# EAGLE design POVD-2 (EAGLE 6.6.0)
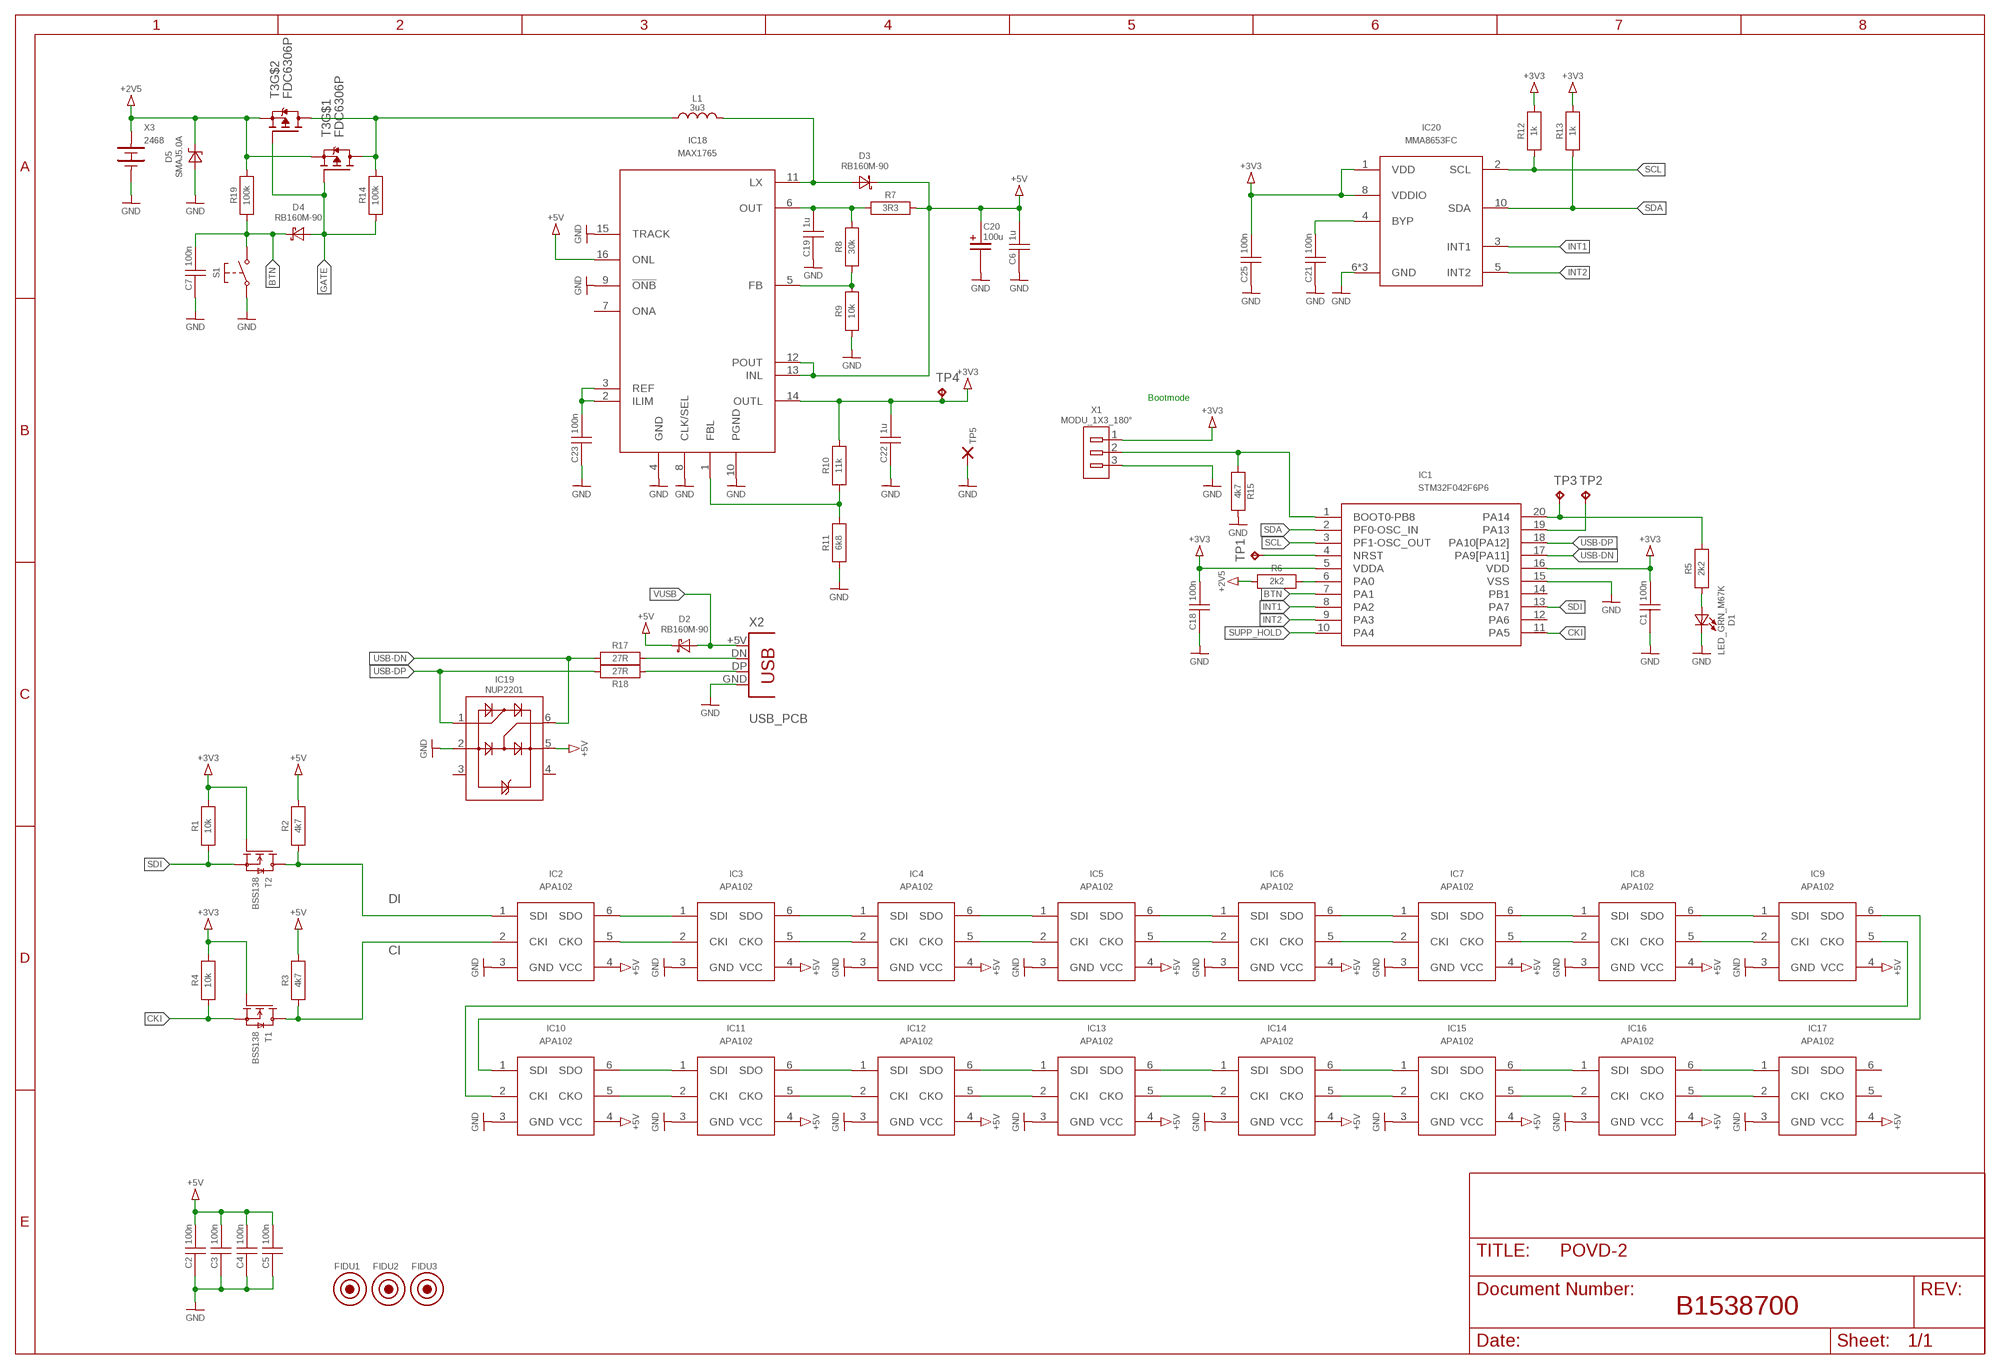
[diagram p0: schematic, sheet 1]

## Parts
C1  100n  C1206  [SM_1206]
C2  100n  C1206  [SM_1206]
C3  100n  C1206  [SM_1206]
C4  100n  C1206  [SM_1206]
C5  100n  C1206  [SM_1206]
C6  1u  C1206  [SM_1206]
C7  100n  C1206  [SM_1206]
C18  100n  C1206  [SM_1206]
C19  1u  C1206  [SM_1206]
C20  100u  CPOLSIZE-D  [SM_SIZE-D]
C21  100n  C1206  [SM_1206]
C22  1u  C1206  [SM_1206]
C23  100n  C1206  [SM_1206]
C25  100n  C1206  [SM_1206]
D1  LED_GRN_M67K  [SM_LED_M67K]
D2  RB160M-90  [SM_SOD123_POL]
D3  RB160M-90  [SM_SOD123_POL]
D4  RB160M-90  [SM_SOD123_POL]
D5  SMAJ5.0A  [SM_DO214AC_POL]
FIDU1  FIDU_ROUND_NEW  [FIDUCIAL_LOETSTOPP]
FIDU2  FIDU_ROUND_NEW  [FIDUCIAL_LOETSTOPP]
FIDU3  FIDU_ROUND_NEW  [FIDUCIAL_LOETSTOPP]
IC1  STM32F042F6P6  [SM_TSSOP20]
IC2  APA102  [SM_LED_PLCC6]
IC3  APA102  [SM_LED_PLCC6]
IC4  APA102  [SM_LED_PLCC6]
IC5  APA102  [SM_LED_PLCC6]
IC6  APA102  [SM_LED_PLCC6]
IC7  APA102  [SM_LED_PLCC6]
IC8  APA102  [SM_LED_PLCC6]
IC9  APA102  [SM_LED_PLCC6]
IC10  APA102  [SM_LED_PLCC6]
IC11  APA102  [SM_LED_PLCC6]
IC12  APA102  [SM_LED_PLCC6]
IC13  APA102  [SM_LED_PLCC6]
IC14  APA102  [SM_LED_PLCC6]
IC15  APA102  [SM_LED_PLCC6]
IC16  APA102  [SM_LED_PLCC6]
IC17  APA102  [SM_LED_PLCC6]
IC18  MAX1765  [SM_QSOP16]
IC19  NUP2201  [TSOP6]
IC20  MMA8653FC  [SM_DFN10]
L1  3u3  L_MOS6020  [SM_L_MOS6020]
R1  10k  R1206  [SM_1206]
R2  4k7  R1206  [SM_1206]
R3  4k7  R1206  [SM_1206]
R4  10k  R1206  [SM_1206]
R5  2k2  R1206  [SM_1206]
R6  2k2  R1206  [SM_1206]
R7  3R3  R1206  [SM_1206]
R8  30k  R1206  [SM_1206]
R9  10k  R1206  [SM_1206]
R10  11k  R1206  [SM_1206]
R11  6k8  R1206  [SM_1206]
R12  1k  R1206  [SM_1206]
R13  1k  R1206  [SM_1206]
R14  100k  R1206  [SM_1206]
R15  4k7  R1206  [SM_1206]
R17  27R  R1206  [SM_1206]
R18  27R  R1206  [SM_1206]
R19  100k  R1206  [SM_1206]
S1  PUSH-BUTTON_SMD  [PUSH-BUTTON_SMD]
T1  BSS138  [SM_SOT23]
T2  BSS138  [SM_SOT23]
T3  FDC6306P  [TSOP6]
TP1  TPTP12R  [TP12R]
TP2  TPTP12R  [TP12R]
TP3  TPTP12R  [TP12R]
TP4  TPTP12R  [TP12R]
TP5  CHECKER_1206  [SM_RCW_1206]
X1  MODU_1X3_180°  [MODU_3X1_180°]
X2  USB_PCB  [USB_PCB]
X3  2468  [2468]

## Nets
+2V5: D5.C R6.2 R19.2 T3.2(S) T3.5(S) X3.POS
+3V3: C1.2 C18.2 C22.2 C25.2 IC1.5(VDDA) IC1.16(VDD) IC18.14(OUTL) IC20.1(VDD) IC20.8(VDDIO) R1.2 R4.2 R10.2 R12.2 R13.2 T1.1(G) T2.1(G) TP4.TP X1.1
+5V: C2.2 C3.2 C4.2 C5.2 C6.2 C20.POS D2.C D3.C IC2.4(VCC) IC3.4(VCC) IC4.4(VCC) IC5.4(VCC) IC6.4(VCC) IC7.4(VCC) IC8.4(VCC) IC9.4(VCC) IC10.4(VCC) IC11.4(VCC) IC12.4(VCC) IC13.4(VCC) IC14.4(VCC) IC15.4(VCC) IC16.4(VCC) IC17.4(VCC) IC18.12(POUT) IC18.13(INL) IC18.16(ONL) IC19.5(VP) R2.2 R3.2 R7.2
BTN: C7.2 D4.C IC1.7(PA1) R19.1 S1.3(S) S1.4(S)
CI: IC2.2(CKI) R3.1 T1.3(D)
CKI: IC1.11(PA5) R4.1 T1.2(S)
DI: IC2.1(SDI) R2.1 T2.3(D)
GATE: D4.A R14.1 T3.1(G) T3.3(G)
GND: C1.1 C2.1 C3.1 C4.1 C5.1 C6.1 C7.1 C18.1 C19.1 C20.NEG C21.1 C22.1 C23.1 C25.1 D1.C D5.A IC1.15(VSS) IC2.3(GND) IC3.3(GND) IC4.3(GND) IC5.3(GND) IC6.3(GND) IC7.3(GND) IC8.3(GND) IC9.3(GND) IC10.3(GND) IC11.3(GND) IC12.3(GND) IC13.3(GND) IC14.3(GND) IC15.3(GND) IC16.3(GND) IC17.3(GND) IC18.4(GND) IC18.8(CLK/SEL) IC18.9(!ONB) IC18.10(PGND) IC18.15(TRACK) IC19.2(GND) IC20.6(GND) IC20.7(GND) IC20.9(GND) R9.1 R11.1 R15.2 S1.1(P) S1.2(P) TP5.1(P) X1.3 X2.GND X3.NEG
INT1: IC1.8(PA2) IC20.3(INT1)
INT2: IC1.9(PA3) IC20.5(INT2)
N$1: IC2.6(SDO) IC3.1(SDI)
N$2: IC2.5(CKO) IC3.2(CKI)
N$3: R17.2 X2.DN
N$4: IC3.6(SDO) IC4.1(SDI)
N$5: IC3.5(CKO) IC4.2(CKI)
N$6: R18.1 X2.DP
N$7: IC4.6(SDO) IC5.1(SDI)
N$8: IC4.5(CKO) IC5.2(CKI)
N$9: D1.A R5.1
N$10: IC6.6(SDO) IC7.1(SDI)
N$11: IC6.5(CKO) IC7.2(CKI)
N$12: IC1.6(PA0) R6.1
N$13: IC7.6(SDO) IC8.1(SDI)
N$14: IC7.5(CKO) IC8.2(CKI)
N$15: L1.1 R14.2 T3.4(D) T3.6(D)
N$16: IC8.6(SDO) IC9.1(SDI)
N$17: IC8.5(CKO) IC9.2(CKI)
N$18: IC1.4(NRST) TP1.TP
N$19: IC10.6(SDO) IC11.1(SDI)
N$20: IC10.5(CKO) IC11.2(CKI)
N$21: IC1.1(BOOT0-PB8) R15.1 X1.2
N$22: IC11.6(SDO) IC12.1(SDI)
N$23: IC11.5(CKO) IC12.2(CKI)
N$24: IC1.20(PA14) R5.2 TP3.TP
N$25: IC12.6(SDO) IC13.1(SDI)
N$26: IC12.5(CKO) IC13.2(CKI)
N$27: IC1.19(PA13) TP2.TP
N$28: IC14.6(SDO) IC15.1(SDI)
N$29: IC14.5(CKO) IC15.2(CKI)
N$31: IC15.6(SDO) IC16.1(SDI)
N$32: IC15.5(CKO) IC16.2(CKI)
N$33: C19.2 IC18.6(OUT) R7.1 R8.2
N$34: IC16.6(SDO) IC17.1(SDI)
N$35: IC16.5(CKO) IC17.2(CKI)
N$36: IC18.5(FB) R8.1 R9.2
N$37: D3.A IC18.11(LX) L1.2
N$38: IC5.5(CKO) IC6.2(CKI)
N$39: IC5.6(SDO) IC6.1(SDI)
N$40: IC18.1(FBL) R10.1 R11.2
N$41: IC9.5(CKO) IC10.2(CKI)
N$42: IC9.6(SDO) IC10.1(SDI)
N$44: IC13.5(CKO) IC14.2(CKI)
N$45: IC13.6(SDO) IC14.1(SDI)
N$46: C21.2 IC20.4(BYP)
N$48: C23.2 IC18.2(ILIM) IC18.3(REF)
SCL: IC1.3(PF1-OSC_OUT) IC20.2(SCL) R12.1
SDA: IC1.2(PF0-OSC_IN) IC20.10(SDA) R13.1
SDI: IC1.13(PA7) R1.1 T2.2(S)
SUPP_HOLD: IC1.10(PA4)
USB-DN: IC1.17(PA9[PA11]) IC19.6(IO2) R17.1
USB-DP: IC1.18(PA10[PA12]) IC19.1(IO1) R18.2
VUSB: D2.A X2.+5V
Unconnected: IC1.12(PA6) IC1.14(PB1) IC17.5(CKO) IC17.6(SDO) IC18.7(ONA) IC19.3(NC1) IC19.4(NC2)

## Notes on the sheet
- Bootmode
- B1538700

## Library data of the parts
C1-C5 C7 C18 C21 C23 C25 = DTP_RCL:C: Capacitor IMS: IMS Capacitors <file:\\omicron.at\dfs\GLOBAL\OMICRON\Synergies\Innovation\Components\CompIMS\_html\Capacitor.html> Version Date Employee Description 1.0 2015-07-15 ChrRaj00 Initial Version; PARTNR: E0001400
C6 C19 C22 = DTP_RCL:C: Capacitor IMS: IMS Capacitors <file:\\omicron.at\dfs\GLOBAL\OMICRON\Synergies\Innovation\Components\CompIMS\_html\Capacitor.html> Version Date Employee Description 1.0 2015-07-15 ChrRaj00 Initial Version; PARTNR: E0487200
C20 = DTP_RCL:CPOL: Capacitor IMS: IMS Capacitors polarized <file:\\omicron.at\dfs\GLOBAL\OMICRON\Synergies\Innovation\Components\CompIMS\_html\Capacitor_Polarized.html> Version Date Employee Description 1.0 2015-08-26 ChrRaj00 Initial Version; PARTNR: E0242200
D1 = LED:LED: LED IMS Master M67K: E0620600 <file:\\omicron.at\dfs\GLOBAL\OMICRON\Synergies\Innovation\Components\CompIMS\Optical\LED\E0620600_LS_M67K-J2L1-1\E0620600.html> IMS Master LGA67K: E0392701 <file:\\omicron.at\dfs\GLOBAL\OMICRON\Synergies\Innovation\Components\CompIMS\Optical\LED\E0392701_LGA67K\E0392701.html> Version Date Employee Description 1.1 2016-05-02 MarStr00 Added 90° LEDs 1.0 2015-11-03 MarStr00 Initial Version; INFO: Function?; PARTNR: E0620700
D2-D4 = Diode:RB160M-90: Diode RB160M-90 Vr = 90V Vf = 0.73V If = 1A Cj = 12pF IMS: E0617200 <file:\\omicron.at\dfs\GLOBAL\OMICRON\Synergies\Innovation\Components\CompIMS\Diode\Schottky\E0617200_RB160M-90\E0617200.html> History Version Date Employee Description 1.0 2015-08-10 ChrRaj00 InitialVersion; PARTNR: E0617200
D5 = Diode:SMAJ*A: SMAJ TVS unidir DO214AC SMAJ15A: Vrmin = 16.7 V Cj = 400 pF Ppulse = 400 W IMS: E1126800 <file:\\omicron.at\dfs\GLOBAL\OMICRON\Synergies\Innovation\Components\CompIMS\Diode\TVS\E1126800_SMCJ15A\E1126800.html> Version Date Employee Description 1.1 2016-01-12 MarStr00 Renamed device with wildcard 1.0 2015-09-15 MarStr00 Initial Version; PARTNR: E1127500
FIDU1-FIDU3 = DTP_Misc:FIDU_ROUND_NEW: Use this Fiducial for new projects!! Fiducial filled with solder mask
IC1 = POVLibrary:STM32F042F6P6
IC2-IC17 = POVLibrary:APA102
IC18 = POVLibrary:MAX1765
IC19 = DTP_IC:NUP2201: ESD Protection Diodes with Low Clamping Voltage NUP2201MR6 IMS: E0439000 <file://omicron.at/dfs/GLOBAL/OMICRON/Synergies/Innovation/Components/CompIMS/Diode/TVS/E0439000_NUP2201MR6/E0439000.html> Version Date Employee Description 1.0 ? ? Initial Version 1.1 2016-04-12 MarSch06 added description; PARTNR: E0439000
IC20 = POVLibrary:MMA8653FC
L1 = DTP_RCL:L: Inductor IMS: IMS Inductors <file:\\omicron.at\dfs\GLOBAL\OMICRON\Synergies\Innovation\Components\CompIMS\_html\Inductor.html> Version Date Employee Description 1.0 2015-07-15 ChrRaj00 Initial Version; PARTNR: E0517800
R1 R4 R9 = DTP_RCL:R: Resistor IMS: IMS Resistors <file:\\omicron.at\dfs\GLOBAL\OMICRON\Synergies\Innovation\Components\CompIMS\_html\Resistor_Standard.html> Version Date Employee Description 1.4 2015-10-20 MarAig00 Added 4723 Package 1.3 2015-10-08 MarStr00 Added KH208-8 package 1.2 2015-10-01 MarStr00 Added 1218 package 1.1 2015-09-14 MarStr00 Added MELF0207 and 2512 packages 1.0 2015-07-15 ChrRaj00 Initial Version; PARTNR: E0002700
R2 R3 R15 = DTP_RCL:R: Resistor IMS: IMS Resistors <file:\\omicron.at\dfs\GLOBAL\OMICRON\Synergies\Innovation\Components\CompIMS\_html\Resistor_Standard.html> Version Date Employee Description 1.4 2015-10-20 MarAig00 Added 4723 Package 1.3 2015-10-08 MarStr00 Added KH208-8 package 1.2 2015-10-01 MarStr00 Added 1218 package 1.1 2015-09-14 MarStr00 Added MELF0207 and 2512 packages 1.0 2015-07-15 ChrRaj00 Initial Version; PARTNR: E0002200
R5 R6 = DTP_RCL:R: Resistor IMS: IMS Resistors <file:\\omicron.at\dfs\GLOBAL\OMICRON\Synergies\Innovation\Components\CompIMS\_html\Resistor_Standard.html> Version Date Employee Description 1.4 2015-10-20 MarAig00 Added 4723 Package 1.3 2015-10-08 MarStr00 Added KH208-8 package 1.2 2015-10-01 MarStr00 Added 1218 package 1.1 2015-09-14 MarStr00 Added MELF0207 and 2512 packages 1.0 2015-07-15 ChrRaj00 Initial Version; PARTNR: E0066600
R7 = DTP_RCL:R: Resistor IMS: IMS Resistors <file:\\omicron.at\dfs\GLOBAL\OMICRON\Synergies\Innovation\Components\CompIMS\_html\Resistor_Standard.html> Version Date Employee Description 1.4 2015-10-20 MarAig00 Added 4723 Package 1.3 2015-10-08 MarStr00 Added KH208-8 package 1.2 2015-10-01 MarStr00 Added 1218 package 1.1 2015-09-14 MarStr00 Added MELF0207 and 2512 packages 1.0 2015-07-15 ChrRaj00 Initial Version; PARTNR: E0821300
R8 R10 = DTP_RCL:R: Resistor IMS: IMS Resistors <file:\\omicron.at\dfs\GLOBAL\OMICRON\Synergies\Innovation\Components\CompIMS\_html\Resistor_Standard.html> Version Date Employee Description 1.4 2015-10-20 MarAig00 Added 4723 Package 1.3 2015-10-08 MarStr00 Added KH208-8 package 1.2 2015-10-01 MarStr00 Added 1218 package 1.1 2015-09-14 MarStr00 Added MELF0207 and 2512 packages 1.0 2015-07-15 ChrRaj00 Initial Version
R11 = DTP_RCL:R: Resistor IMS: IMS Resistors <file:\\omicron.at\dfs\GLOBAL\OMICRON\Synergies\Innovation\Components\CompIMS\_html\Resistor_Standard.html> Version Date Employee Description 1.4 2015-10-20 MarAig00 Added 4723 Package 1.3 2015-10-08 MarStr00 Added KH208-8 package 1.2 2015-10-01 MarStr00 Added 1218 package 1.1 2015-09-14 MarStr00 Added MELF0207 and 2512 packages 1.0 2015-07-15 ChrRaj00 Initial Version; PARTNR: E0195100
R12 R13 = DTP_RCL:R: Resistor IMS: IMS Resistors <file:\\omicron.at\dfs\GLOBAL\OMICRON\Synergies\Innovation\Components\CompIMS\_html\Resistor_Standard.html> Version Date Employee Description 1.4 2015-10-20 MarAig00 Added 4723 Package 1.3 2015-10-08 MarStr00 Added KH208-8 package 1.2 2015-10-01 MarStr00 Added 1218 package 1.1 2015-09-14 MarStr00 Added MELF0207 and 2512 packages 1.0 2015-07-15 ChrRaj00 Initial Version; PARTNR: E0002500
R14 R19 = DTP_RCL:R: Resistor IMS: IMS Resistors <file:\\omicron.at\dfs\GLOBAL\OMICRON\Synergies\Innovation\Components\CompIMS\_html\Resistor_Standard.html> Version Date Employee Description 1.4 2015-10-20 MarAig00 Added 4723 Package 1.3 2015-10-08 MarStr00 Added KH208-8 package 1.2 2015-10-01 MarStr00 Added 1218 package 1.1 2015-09-14 MarStr00 Added MELF0207 and 2512 packages 1.0 2015-07-15 ChrRaj00 Initial Version; PARTNR: E0002800
R17 R18 = DTP_RCL:R: Resistor IMS: IMS Resistors <file:\\omicron.at\dfs\GLOBAL\OMICRON\Synergies\Innovation\Components\CompIMS\_html\Resistor_Standard.html> Version Date Employee Description 1.4 2015-10-20 MarAig00 Added 4723 Package 1.3 2015-10-08 MarStr00 Added KH208-8 package 1.2 2015-10-01 MarStr00 Added 1218 package 1.1 2015-09-14 MarStr00 Added MELF0207 and 2512 packages 1.0 2015-07-15 ChrRaj00 Initial Version; PARTNR: E0023100
S1 = DTP_Switch:PUSH-BUTTON_SMD: Push Button Switch For SMD mounting Max Switching: 50mA @ 12V Switches:1 E-Nr.: E0869600 History Version Date Employee Description 1.0 2015.04.23 DanWin00 Initial Version; PARTNR: E0869600
T1 T2 = FET:BSS138: BSS138 NMOSFET 50V 0.2A 3E5 SOT23 Vmax = 50V Icont =0.2A Pd = 360mW Rdson = 3.5Ohm IMS: E0277100 <file:\\omicron.at\dfs\GLOBAL\OMICRON\Synergies\Innovation\Components\CompIMS\Transistor\NMOS\E0277100_BSS138\E0277100.html> History Version Date Employee Description 1.0 2015-11-13 ChrRaj00 Initial Version; PARTNR: E0277100
T3 = DTP_Semicond:FDC6306P; PARTNR: E0662100
TP1-TP4 = DTP_Connectors:TP: Test pad
TP5 = DTP_Connectors:CHECKER_1206: Checker 1p 1206 SMD RCWCTE IMS: E0395500 <\\omicron.at\DFS\GLOBAL\OMICRON\Synergies\Innovation\Components\CompIMS\Connector\5-PCB/E0395500_Checker_1p_1206_SMD_RCWCTE/E0395500.html> History Version Date Employee Description 1.1 2015.09.15 MarStr00 Value now visible on silkscreen for labeling 1.0 2014.09.05 ChrJoc00 Added prefix and description; PARTNR: E0395500
X1 = Connector_PCB:MODU_1X3_180°: Header Male 1x3p RM2,54 180° locking PCB Version Date Employee Description 1.0 2016-05-06 MarStr00 Initial Version
X2 = POVLibrary:USB_PCB
X3 = POVLibrary:2468

## Board
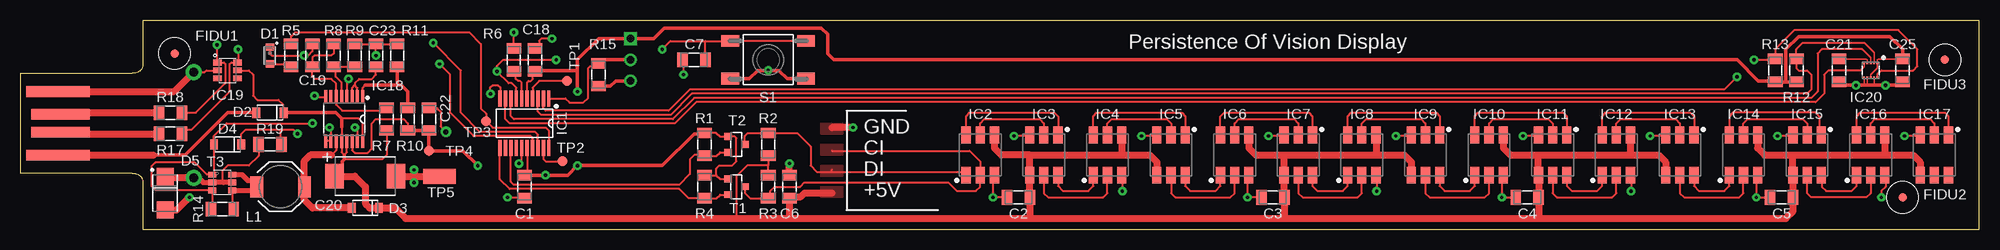
[diagram p1: board, top side]
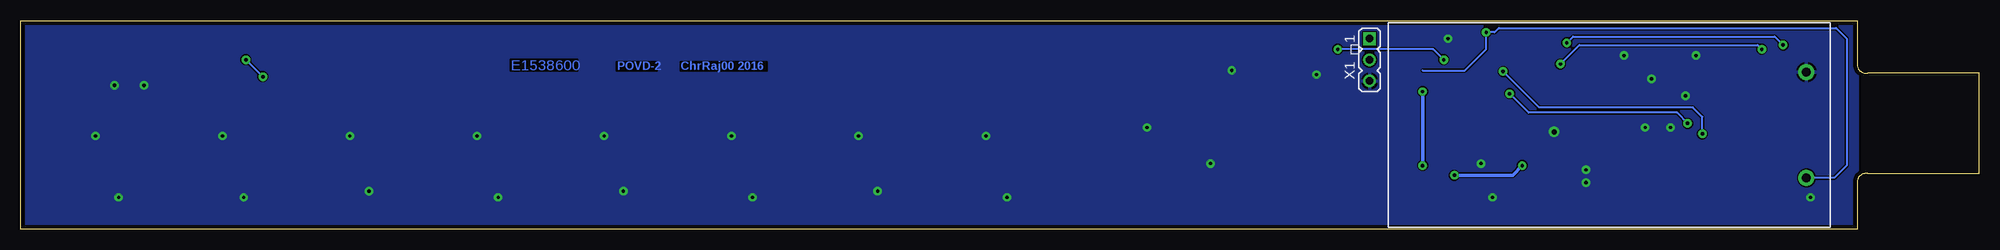
[diagram p2: board, bottom side, seen from below]

Size 234.6 x 25 mm. Coordinates in mm from the lower left corner, seen from the top.
Outline: 13.34,18.73 13.61,18.73 arc90 14.61,19.73 14.61,25 234.6,25 234.6,0 14.61,0 14.61,5.67 arc90 13.61,6.67 13.34,6.67
Copper layers (1*16): Top 0.035mm / dielectric 1.5mm / Bottom 0.035mm
Design rules "OMICRON_2Layer": minimum track width 6mil, minimum drill 0.3mm, track to track 6mil, track to pad 6mil, pad to pad 6mil, via to via 6mil, smd to smd 6mil, copper to edge 0.5mm, drill to drill 0.3mm, minimum pad ring 12mil, minimum via ring 12mil, stop-mask expansion 0mil, vias tented up to drill 0.3mm, thermal gap 10mil

### Footprints (pad centres in the part's own frame; a part is rotated, then mirrored left to right if it is on the bottom)
SM_1206 = smd 1.25 x 1.75: 1 -1.375,0; 2 1.375,0
SM_SIZE-D = smd 2.2 x 2.9: NEG 3.683,0; POS -3.683,0
SM_LED_M67K = smd 0.86 x 1.01: A -1,0; C 1,0
SM_SOD123_POL = smd 0.92 x 1.22: A -1.64,0; C 1.64,0
SM_DO214AC_POL = smd 2.03 x 2.03: A -2.032,0; C 2.032,0
FIDUCIAL_LOETSTOPP = smd 1.016 x 1.016: P$1 0,0
SM_TSSOP20 = smd 0.4 x 1.88: 1 -2.925,-2.97; 2 -2.275,-2.97; 3 -1.625,-2.97; 4 -0.975,-2.97; 5 -0.325,-2.97; 6 0.325,-2.97; 7 0.975,-2.97; 8 1.625,-2.97; 9 2.275,-2.97; 10 2.925,-2.97; 11 2.925,2.97; 12 2.275,2.97; 13 1.625,2.97; 14 0.975,2.97; 15 0.325,2.97; 16 -0.325,2.97; 17 -0.975,2.97; 18 -1.625,2.97; 19 -2.275,2.97; 20 -2.925,2.97
SM_LED_PLCC6 = smd 2 x 1.1: 1 -2.4,1.7; 2 -2.4,0; 3 -2.4,-1.7; 4 2.4,-1.7; 5 2.4,0; 6 2.4,1.7
SM_QSOP16 = smd 0.36 x 1.6: 1 -2.223,-2.655; 2 -1.587,-2.655; 3 -0.953,-2.655; 4 -0.318,-2.655; 5 0.318,-2.655; 6 0.953,-2.655; 7 1.587,-2.655; 8 2.223,-2.655; 9 2.223,2.655; 10 1.587,2.655; 11 0.953,2.655; 12 0.318,2.655; 13 -0.318,2.655; 14 -0.953,2.655; 15 -1.587,2.655; 16 -2.223,2.655
TSOP6 = smd 1 x 0.7: 1 -1.2,0.95; 2 -1.2,0; 3 -1.2,-0.95; 4 1.2,-0.95; 5 1.2,0; 6 1.2,0.95
SM_DFN10 = smd 0.3 x 0.225: 1 -0.9,0.8; 2 -0.9,0.4; 3 -0.9,0; 4 -0.9,-0.4; 5 -0.9,-0.8; 6 0.9,-0.8; 7 0.9,-0.4; 8 0.9,0; 9 0.9,0.4; 10 0.9,0.8
SM_L_MOS6020 = smd 1.52 x 2.54: 1 2.857,0; 2 -2.857,0
PUSH-BUTTON_SMD = smd 2.1 x 1.4: 1 -4.55,2.25; 2 4.55,2.25; 3 -4.55,-2.25; 4 4.55,-2.25
SM_SOT23 = smd 0.8 x 0.9: 1 -0.95,-1; 2 0.95,-1; 3 0,1
TP12R = smd 1.2 x 1.2: TP 0,0
SM_RCW_1206 = smd 1.8 x 3.9: 1 0,0
MODU_3X1_180° = drill 0.9 pad 1.52 square: 1 -2.54,0 | drill 0.9 pad 1.52: 2 0,0; 3 2.54,0
USB_PCB = smd 1.27 x 7.62: +5V -3.81,8.89; GND 3.81,8.89 | smd 1.27 x 6.985: DN -1.079,8.572; DP 1.079,8.572
2468 = drill 1.1 pad 1.93: NEG 23.625,6.35; POS 23.625,-6.35

### Placement (x,y rotation side)
C1  60.33,5.08 90 top
C2  119.51,3.81 0 top
C3  149.99,3.81 0 top
C4  180.47,3.81 0 top
C5  210.95,3.81 0 top
C6  92.08,5.08 270 top
C7  80.65,20.32 0 top
C18  61.59,20.32 270 top
C19  34.92,20.83 270 top
C20  41.28,6.35 0 top
C21  217.8,19.05 90 top
C22  48.89,13.21 270 top
C23  42.55,20.83 270 top
C25  225.42,19.05 90 top
D1  29.84,20.83 90 top
D2  29.84,13.97 0 top
D3  41.28,2.54 0 top
D4  24.77,10.16 0 top
D5  17.27,4.32 90 top
FIDU1  18.41,21.08 90 top
FIDU2  225.42,3.81 90 top
FIDU3  230.5,20.32 180 top
IC1  60.33,12.7 180 top
IC2  114.94,8.89 90 top
IC3  122.56,8.89 270 top
IC4  130.17,8.89 90 top
IC5  137.79,8.89 270 top
IC6  145.41,8.89 90 top
IC7  153.03,8.89 270 top
IC8  160.66,8.89 90 top
IC9  168.27,8.89 270 top
IC10  175.89,8.89 90 top
IC11  183.51,8.89 270 top
IC12  191.13,8.89 90 top
IC13  198.75,8.89 270 top
IC14  206.38,8.89 90 top
IC15  213.99,8.89 270 top
IC16  221.61,8.89 90 top
IC17  229.23,8.89 270 top
IC18  38.73,13.21 180 top
IC19  24.77,19.05 0 top
IC20  221.61,19.05 270 top
L1  31.12,5.08 180 top
R1  81.92,10.16 90 top
R2  89.54,10.16 270 top
R3  89.54,5.08 90 top
R4  81.92,5.08 90 top
R5  32.39,20.83 90 top
R6  59.06,20.32 90 top
R7  43.81,13.21 270 top
R8  37.47,20.83 90 top
R9  40,20.83 270 top
R10  46.36,13.21 270 top
R11  45.09,20.83 270 top
R12  212.72,19.05 270 top
R13  210.19,19.05 270 top
R14  24.13,2.41 0 top
R15  69.22,18.54 270 top
R17  17.91,11.43 180 top
R18  17.91,13.97 0 top
R19  29.84,10.16 180 top
S1  89.54,20.32 180 top
T1  85.73,5.08 270 top
T2  85.73,10.16 270 top
T3  24.13,5.59 0 top
TP1  65.41,17.78 180 top
TP2  64.9,8.13 180 top
TP3  55.75,12.95 180 top
TP4  48.89,9.4 0 top
TP5  50.17,6.35 90 top
X1  73.03,20.32 270 bottom
X2  13.34,12.7 90 top
X3  44.32,12.5 0 bottom

### Tracks (layer width: path | path; a pad name or v marks a point on that pad's centre or on a via)
+2V5  (via drill 0.4)
  Top 0.254: R6.2 v59.06,23.62 | R19.2 28.47,8.79 27.3,7.62 24.77,7.62 24.13,6.99 24.13,5.71 24.26,5.59
  Top 0.61: X3.POS 21.28,6.15 21.84,5.59 T3.2 24.26,5.59 T3.5
  Top 0.813: X3.POS 17.47,6.15 D5.C
  Bottom 0.254: X3.POS 17.34,6.15 15.88,7.62 15.88,22.86 17.14,24.13 57.53,24.13 58.04,23.62 v59.06,23.62 59.06,21.59 61.59,19.05 66.67,19.05
+3V3  (via drill 0.4)
  Top 0.2: C25.2 222.52,20.43 222.41,20.32 IC20.1 222.41,19.34 221.61,18.54 IC20.8
  Top 0.254: R4.2 83.33,6.46 | 83.33,6.46 83.76,6.03 T1.1 | IC18.14 39.69,9.46 40,9.14 41.53,9.14 42.04,9.65 42.04,12.7 42.55,13.21 45.85,13.21 46.36,12.7 R10.2 | IC1.16 60.65,6.78 C1.2 | IC1.5 60.65,17.6 60.83,17.78 61.09,17.78 61.34,18.03 61.34,18.8 C18.2 | 83.33,6.46 83.33,7.26 83.69,7.62 85.22,7.62 85.73,8.13 85.73,10.92 85.54,11.11 T2.1 83.76,11.11 83.33,11.54 82.02,11.54
  Top 0.406: 225.42,20.32 C25.2 225.42,21.59 223.9,23.11 212.98,23.11 211.45,21.59 211.45,17.68 | 211.45,17.68 R13.2 210.19,17.78 208.15,17.78 205.61,20.32 97.41,20.32 96.65,21.08 96.65,23.37 95.89,24.13 77.09,24.13 75.82,22.86 X1.1 69.22,22.86 66.67,20.32 66.67,19.05 | R12.2 211.45,17.68 | R10.2 C22.2 TP4.TP 52.96,9.4 v54.74,7.62 | 66.67,19.05 61.7,19.05 C18.2 | 81.92,11.43 82.02,11.54 R1.2 81.81,11.43 80.65,11.43 76.83,7.62 v66.67,7.62 65.51,6.46 v62.86,6.46 C1.2 | v66.67,16.51 66.67,19.05
  Bottom 0.406: v54.74,7.62 55.9,6.46 v62.86,6.46 | v66.67,16.51 v66.67,7.62
+5V
  Top 0.254: R3.2 89.54,7.62 | IC18.13 39.05,9.21 38.73,8.89 38.42,9.21 IC18.12 38.42,12.26 | R2.2 89.54,7.62 | 89.54,7.62 87,7.62 85.73,6.35 85.73,1.27 | R7.2 43.81,8.89 43.31,8.38 38.73,8.38 | IC19.5 27.3,19.05 27.81,18.54 27.81,16 28.32,15.49 30.86,15.49 31.37,14.99 31.37,14.09 D2.C | IC18.16 40.96,12.76 40.45,13.27 38.42,13.27
  Top 0.406: 38.73,8.89 38.73,8.38 38.48,8.13 38.48,6.35 C20.POS | D2.C 37.72,13.97 38.42,13.27 38.42,12.26
  Top 0.813: 120.86,8.89 IC3.4 120.88,6.46 C2.2 120.88,1.27 | 120.86,8.89 117.48,8.89 116.64,9.73 IC2.4 | 120.86,8.89 131.88,8.89 | 131.88,8.89 135.25,8.89 136.09,8.05 IC5.4 | IC4.4 131.88,8.89 | IC6.4 147.11,9.73 147.95,8.89 151.33,8.89 | 151.33,8.89 162.35,8.89 | 162.35,8.89 165.73,8.89 166.57,8.05 IC9.4 | IC8.4 162.35,8.89 | 151.33,8.89 IC7.4 151.36,6.46 C3.2 151.36,1.27 | IC10.4 177.59,9.73 178.44,8.89 181.81,8.89 | 181.81,8.89 192.83,8.89 | 192.83,8.89 196.22,8.89 197.05,8.05 IC13.4 | 181.81,8.89 IC11.4 181.84,6.46 C4.2 181.84,1.27 | IC12.4 192.83,8.89 | IC14.4 208.07,9.73 208.91,8.89 212.29,8.89 | 212.29,8.89 223.31,8.89 | 223.31,8.89 226.69,8.89 227.53,8.05 IC17.4 | IC16.4 223.31,8.89 | 212.29,8.89 IC15.4 212.29,3.81 C5.2 212.32,2.14 211.45,1.27 181.84,1.27 | 92.08,1.27 85.73,1.27 46.1,1.27 44.83,2.54 D3.C 41.78,2.54 41.28,3.05 41.28,5.08 40,6.35 38.48,6.35 | 92.08,1.27 120.88,1.27 | 120.88,1.27 151.36,1.27 | 151.36,1.27 181.84,1.27 | 92.08,1.27 C6.2 92.08,3.81 93.34,3.81 93.85,4.32 97.16,4.32
  pour Top: 95.89,3.81 95.89,5.08 98.42,5.08 98.42,3.81
BTN  (via drill 0.4)
  Top 0.254: IC1.7 59.35,16.98 58.8,17.53 58.42,17.53 v57.02,18.92 57.02,19.56 57.78,20.32 v64.14,20.32 | v76.83,21.59 77.81,22.57 82.02,22.57 | 82.02,22.57 S1.4 S1.3 | D4.C 26.41,11.42 26.92,11.94 31.12,11.94 | R19.1 31.12,10.16 31.12,11.94 | 31.12,11.94 32.64,11.94 v33.15,11.43 | C7.2 82.02,22.57
  Bottom 0.254: v64.14,20.32 65.41,21.59 v76.83,21.59 | v33.15,11.43 33.15,13.46 34.29,14.61 52.7,14.61 v57.02,18.92
CI
  Top 0.254: 89.64,3.81 89.79,3.81 89.79,4.57 90.3,5.08 93.34,5.08 93.85,5.59 111.12,5.59 112.14,4.57 114.43,4.57 114.94,5.08 IC2.2 114.94,8.13 113.67,9.4 97.16,9.4 | T1.3 86.73,4.33 87.35,3.71 R3.1
  Top 0.406: 89.64,3.81 R3.1
  pour Top: 95.89,8.89 95.89,10.16 98.42,10.16 98.42,8.89
CKI
  Top 0.254: T1.2 83.76,4.13 83.33,3.71 R4.1 79.99,3.71 78.87,4.83 58.55,4.83 57.4,5.97 IC1.11
DI
  Top 0.254: T2.3 86.73,11.16 87.1,11.54 R2.1 92.99,11.54 94.62,9.91 94.62,7.62 95.38,6.86 97.16,6.86 | 97.16,6.86 112.9,6.86 113.27,6.49 IC2.1 | 97.16,6.86 97.16,7.11
  pour Top: 95.89,6.35 95.89,7.62 98.42,7.62 98.42,6.35
GATE  (via drill 0.4)
  Top 0.254: R14.1 22.93,2.59 T3.3 22.87,4.7 16.13,4.7 15.62,5.21 15.62,7.49 16.13,8 20.83,8 22.29,6.54 T3.1 23.12,6.73 D4.A 23.12,11.19 24.64,12.7 v34.92,12.7 | v56.26,16.26 56.26,17.02 56.52,17.27 57.15,17.27 57.4,17.02 57.4,15.67
  Bottom 0.254: v34.92,12.7 36.2,13.97 53.97,13.97 v56.26,16.26
GND  (via drill 0.4, 0.6)
  Top 0.2: 220.81,17.78 IC20.6 220.81,17.27 | IC20.9 222.01,17.27 221.61,17.27 221.22,17.27 IC20.7
  Top 0.254: v36.96,12.19 37.15,12 IC18.10 IC18.9 | v40,12.19 40.32,11.87 IC18.15 | v39.24,18.03 39.05,17.84 IC18.4 | v35.18,16 35.32,15.86 IC18.8 | C19.1 34.92,21.34 34.42,20.83 v33.91,20.83 30.1,20.83 29.84,21.08 D1.C | R9.1 C23.1 | C23.1 R11.1 | v42.55,20.83 C23.1 | v58.29,3.81 60.22,3.81 C1.1 | v59.69,7.87 60,8.18 IC1.15 | v63.63,22.86 62.36,22.86 62.1,22.61 62.1,21.84 61.95,21.7 C18.1 | C2.1 v116.46,3.81 116.46,6.31 IC2.3 | IC17.3 227.42,11.18 v225.68,11.18 | IC16.3 223.39,6.41 223.39,5.08 222.88,4.57 v222.88,3.81 | C5.1 v207.9,3.81 207.9,6.31 IC14.3 | IC15.3 212.18,11.18 v210.44,11.18 | IC13.3 196.94,11.18 v195.2,11.18 | IC12.3 192.91,6.41 v192.91,4.57 | IC4.3 131.95,6.41 v131.95,4.57 | IC5.3 135.98,11.18 v134.24,11.18 | IC3.3 120.74,11.18 v119,11.18 | IC7.3 151.22,11.18 v149.48,11.18 | IC6.3 146.94,6.31 v146.94,3.81 C3.1 | IC8.3 162.43,6.41 v162.43,4.57 | IC9.3 166.46,11.18 v164.72,11.18 | IC11.3 181.7,11.18 v179.96,11.18 | IC10.3 177.42,6.31 v177.42,3.81 C4.1 | v50.93,11.68 50.29,12.32 50.29,14.1 49.91,14.48 49,14.48 C22.1 | C7.1 79.38,20.32 v79.38,18.54 | X3.NEG 22.02,18.85 22.23,19.05 IC19.2
  Top 0.406: C21.1 217.8,17.27 v219.84,17.27 220.81,17.27 221.61,17.27 v223.39,17.27 224.92,17.27 224.92,17.68 C25.1 | R15.2 70.63,17.17 71.25,17.78 X1.3 | S1.2 87.29,18.07 88.27,19.05 v89.54,19.05 90.81,19.05 91.79,18.07 S1.1
  Top 0.813: X2.GND 18.36,16.51 X3.NEG | C20.NEG 47.12,6.35 | 47.12,6.35 TP5.1 | v47.12,5.59 47.12,6.35 | v47.12,7.11 47.12,6.35 | v99.7,12.19 97.16,12.19 | C6.1 v92.08,7.87 | D5.A 18.67,2.29 v20.19,3.81
  pour Bottom: 14.61,26.67 14.61,-1.27 235.58,-1.27 235.58,26.67
  pour Top: 95.89,11.43 95.89,12.7 98.42,12.7 98.42,11.43
INT1
  Top 0.2: IC20.3 221.61,20.57 220.6,21.59
  Top 0.254: 220.6,21.59 215.77,21.59 215.26,21.08 215.26,16.51 214.5,15.75 80.65,15.75 78.11,13.21 59.06,13.21 58.7,13.56 IC1.8
INT2
  Top 0.2: IC20.5 220.81,19.52 220.34,19.05
  Top 0.254: 220.34,19.05 216.53,19.05 216.03,18.54 216.03,16.26 215.01,15.24 80.9,15.24 78.36,12.7 58.55,12.7 58.05,13.2 IC1.9
N$1
  Top 0.254: IC2.6 113.23,13.54 113.67,13.97 123.83,13.97 124.26,13.54 IC3.1
N$2
  Top 0.254: IC2.5 114.94,12.7 115.44,13.21 122.05,13.21 122.56,12.7 IC3.2
N$3
  Top 0.254: X2.DN 4.95,11.43
  Top 0.813: 4.95,11.43 R17.2
N$4
  Top 0.254: IC3.6 124.26,5.16 124.84,4.57 127.89,4.57 128.47,5.16 IC4.1
N$5
  Top 0.254: IC3.5 122.56,4.32 123.06,3.81 129.67,3.81 130.17,4.32 IC4.2
N$6
  Top 0.254: X2.DP 4.95,13.97
  Top 0.813: 4.95,13.97 R18.1
N$7
  Top 0.254: IC4.6 128.47,13.54 128.91,13.97 139.06,13.97 139.5,13.54 IC5.1
N$8
  Top 0.254: IC4.5 130.17,12.7 130.68,13.21 137.29,13.21 137.79,12.7 IC5.2
N$9
  Top 0.254: D1.A 32.01,19.83 R5.1
N$10
  Top 0.254: IC6.6 143.72,13.54 144.14,13.97 154.3,13.97 154.73,13.54 IC7.1
N$11
  Top 0.254: IC6.5 145.41,12.7 145.92,13.21 152.53,13.21 153.03,12.7 IC7.2
N$12
  Top 0.254: IC1.6 60,17.6 59.82,17.78 59.56,17.78 59.31,18.03 59.31,18.8 R6.1
N$13
  Top 0.254: IC7.6 154.73,5.16 155.32,4.57 158.37,4.57 158.95,5.16 IC8.1
N$14
  Top 0.254: IC7.5 153.03,4.32 153.54,3.81 160.15,3.81 160.66,4.32 IC8.2
N$15
  Top 0.254: T3.4 25.33,2.59 R14.2
  Top 0.61: T3.4 27.82,4.64 L1.1 28.32,5.14 28.32,5.71 28.19,5.84 27.18,5.84 26.48,6.54 T3.6
N$16
  Top 0.254: IC8.6 158.95,13.54 159.38,13.97 169.54,13.97 169.97,13.54 IC9.1
N$17
  Top 0.254: IC8.5 160.66,12.7 161.16,13.21 167.77,13.21 168.27,12.7 IC9.2
N$18
  Top 0.254: TP1.TP 62.1,17.78 61.3,16.98 IC1.4
N$19
  Top 0.254: IC10.6 174.19,13.54 174.62,13.97 184.78,13.97 185.22,13.54 IC11.1
N$20
  Top 0.254: IC10.5 175.89,12.7 176.4,13.21 183.01,13.21 183.51,12.7 IC11.2
N$21
  Top 0.254: IC1.1 65.23,15.67 65.74,15.16 67.36,15.16 67.95,15.75 67.95,19.3 68.2,19.56 68.86,19.56 R15.1
  Top 0.406: R15.1 69.62,20.32 X1.2
N$22
  Top 0.254: IC11.6 185.22,5.16 185.8,4.57 188.85,4.57 189.44,5.16 IC12.1
N$23
  Top 0.254: IC11.5 183.51,4.32 184.02,3.81 190.63,3.81 191.13,4.32 IC12.2
N$24
  Top 0.254: R5.2 32.39,23.11 32.89,23.62 53.72,23.62 55.12,22.23 55.12,14.48 55.75,13.84 TP3.TP 56.52,12.19 62.86,12.19 63.25,11.81 IC1.20
N$25
  Top 0.254: IC12.6 189.44,13.54 189.86,13.97 200.02,13.97 200.45,13.54 IC13.1
N$26
  Top 0.254: IC12.5 191.13,12.7 191.64,13.21 198.25,13.21 198.75,12.7 IC13.2
N$27
  Top 0.254: IC1.19 62.6,8.39 62.86,8.13 TP2.TP
N$28
  Top 0.254: 215.52,11.47 215.52,13.46 215.01,13.97 205.1,13.97 204.67,13.54 IC14.6
  Top 0.406: IC15.1 215.52,11.47
N$29
  Top 0.254: IC14.5 206.38,12.7 206.88,13.21 213.49,13.21 213.99,12.7 IC15.2
N$31
  Top 0.254: 215.77,6.41 215.77,5.08 216.28,4.57 219.33,4.57 219.91,5.16 IC16.1
  Top 0.406: IC15.6 215.77,6.41
N$32
  Top 0.254: IC16.2 221.61,4.32 221.11,3.81 214.5,3.81 213.99,4.32 IC15.5
N$33
  Top 0.254: R7.1 43.46,14.22 38.48,14.22 37.78,14.92 IC18.6 37.78,17.46 37.21,18.03 35.18,18.03 34.92,18.29 C19.2 34.92,20.57 35.18,20.83 37.21,20.83 37.47,21.08 R8.2
N$34
  Top 0.254: IC16.6 219.91,13.54 220.34,13.97 230.5,13.97 230.94,13.54 IC17.1
N$35
  Top 0.254: IC16.5 221.61,12.7 222.12,13.21 228.73,13.21 229.23,12.7 IC17.2
N$36
  Top 0.254: IC18.5 38.42,17.59 37.72,18.29 37.72,19.05 R8.1 R9.2
N$37
  Top 0.254: IC18.11 37.78,9.46 37.21,8.89
  Top 0.813: 37.21,8.89 34.67,8.89 33.97,8.19 L1.2 33.97,3.49 34.92,2.54 D3.A
N$38
  Top 0.254: IC5.5 137.79,4.32 138.3,3.81 144.91,3.81 145.41,4.32 IC6.2
N$39
  Top 0.254: IC5.6 139.5,5.16 140.08,4.57 143.13,4.57 143.72,5.16 IC6.1
N$40
  Top 0.254: IC18.1 40.96,16.95 41.28,17.27
  Top 0.406: R11.2 45.09,17.27 | 45.09,17.27 45.59,17.27 46.36,16.51 R10.1 | 41.28,17.27 45.09,17.27
N$41
  Top 0.254: IC9.5 168.27,4.32 168.78,3.81 175.39,3.81 175.89,4.32 IC10.2
N$42
  Top 0.254: IC9.6 169.97,5.16 170.56,4.57 173.61,4.57 174.19,5.16 IC10.1
N$44
  Top 0.254: IC13.5 198.75,4.32 199.26,3.81 205.87,3.81 206.38,4.32 IC14.2
N$45
  Top 0.254: IC13.6 200.45,5.16 201.04,4.57 204.09,4.57 204.67,5.16 IC14.1
N$46
  Top 0.2: IC20.4 221.22,20.32 221.11,20.43 C21.2
N$48
  Top 0.254: C23.2 42.55,18.54 42.04,18.03 40.51,18.03 40,17.53 40,17.27 | IC18.3 39.69,16.95 40,17.27 | IC18.2 40.32,16.95 40,17.27
SCL
  Top 0.2: 222.01,20.32 IC20.2 222.01,21.19
  Top 0.254: 222.01,21.19 220.85,22.35 213.49,22.35 212.72,21.59 R12.1 212.72,19.3 212.98,19.05 213.99,19.05 214.5,18.54 214.5,16.76 213.99,16.26 80.39,16.26 77.85,13.72 62.36,13.72 61.95,14.12 IC1.3
SDA  (via drill 0.4)
  Top 0.2: IC20.10 222.41,18.58 222.88,19.05
  Top 0.254: 222.88,19.05 226.69,19.05 227.2,19.56 227.2,21.59 224.92,23.88 212.47,23.88 210.19,21.59 R13.1 209.78,20.43 209.68,20.32 v207.64,20.32 | IC1.2 62.6,14.49 62.86,14.22 77.6,14.22 80.14,16.76 204.09,16.76 v205.61,18.29
  Top 0.406: R13.1 210.19,20.32
  Bottom 0.254: v205.61,18.29 v207.64,20.32
SDI
  Top 0.254: T2.2 83.76,9.21 83.33,8.79 R1.1 81.81,8.89 80.65,8.89 80.14,8.38 80.14,6.6 78.87,5.33 59.06,5.33 58.7,5.69 IC1.13
USB-DN  (via drill 0.4)
  Top 0.254: IC1.17 61.3,10.96 61.09,11.18 54.23,11.18 51.44,13.97 51.44,18.54 v50.17,19.81 | R17.1 19.43,11.58 19.43,11.94 20.45,11.94 25.02,16.51 25.02,19.81 25.21,20 IC19.6 26.04,20.07 v26.04,21.59
  Bottom 0.254: v50.17,19.81 47.88,22.1 26.54,22.1 v26.04,21.59
USB-DP  (via drill 0.4)
  Top 0.254: IC1.18 61.95,11.33 61.59,11.68 54.99,11.68 52.7,13.97 52.7,19.05 v49.4,22.35 | R18.2 20.95,13.97 24.51,17.53 24.51,19.81 24.32,20 IC19.1 23.5,20.07 v23.5,22.1
  Bottom 0.254: v49.4,22.35 48.64,23.11 24.51,23.11 v23.5,22.1
VUSB
  Top 0.406: 15.88,8.89 19.69,8.89 24.77,13.97 D2.A
  Top 0.813: X2.+5V 15.88,8.89

### Text on the board
Bottom: ChrRaj00 2016 | POVD-2 | E1538600
tPlace: Persistence Of Vision Display | GND | CI | DI | +5V